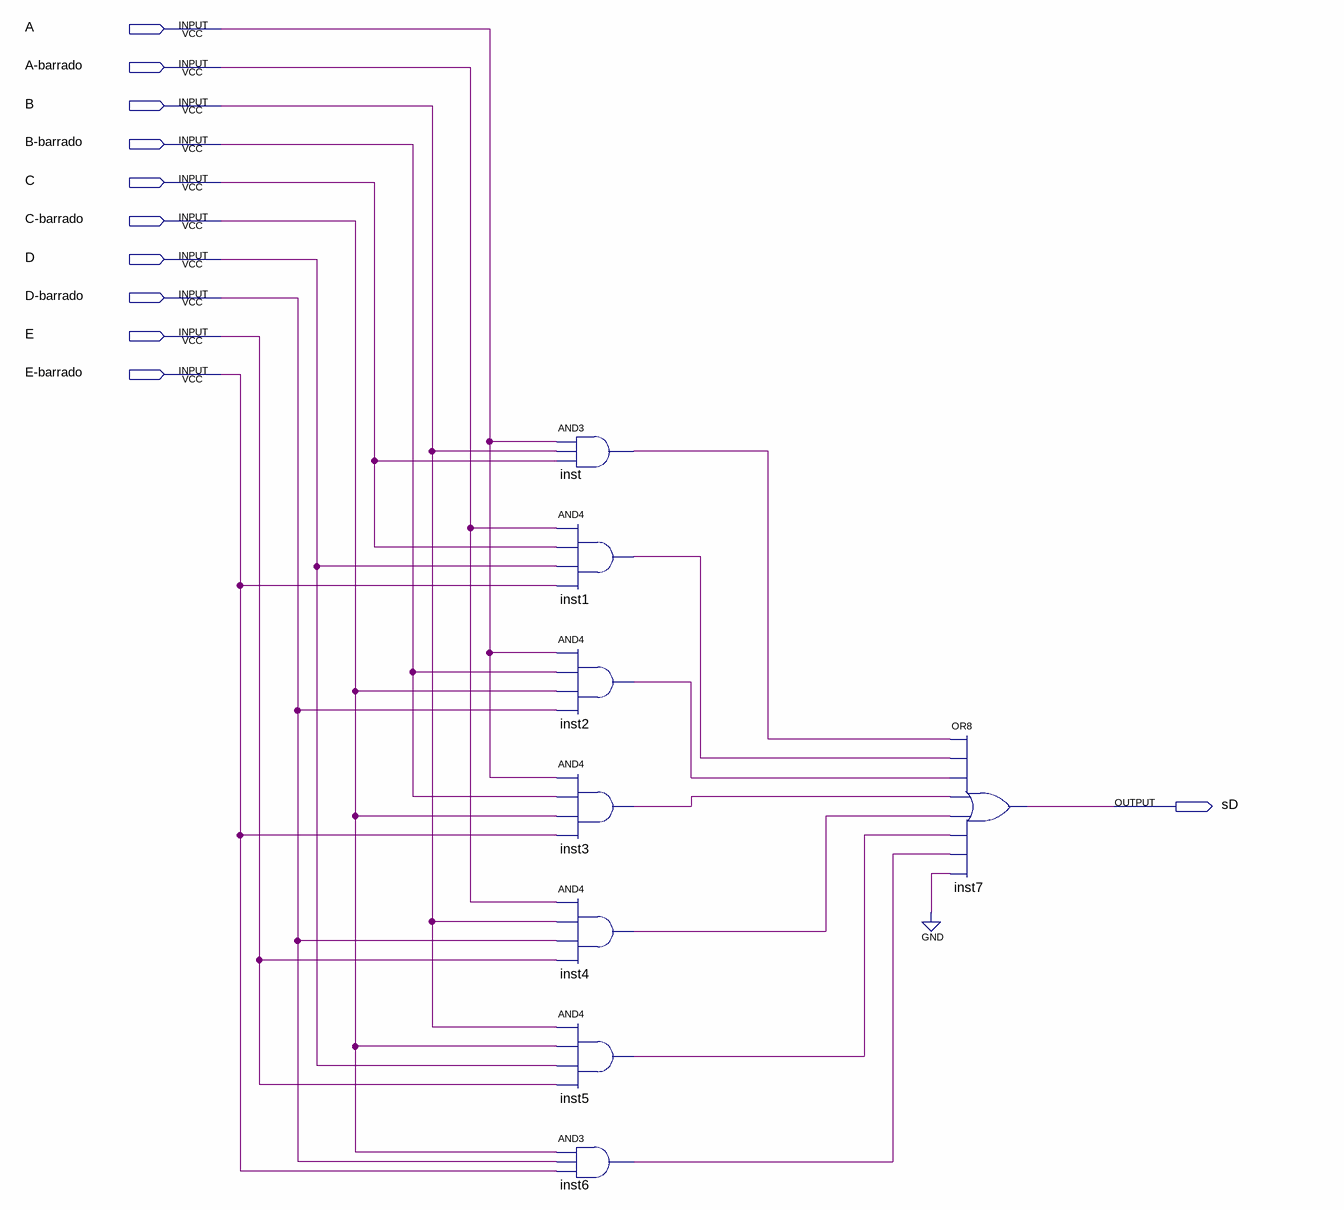
[diagram p0: schematic sheet]
// Quartus schematic saida_D.bdf as structural Verilog: 8 symbols, 11 pins
module saida_D (
  input  A,
  input  \A-barrado ,
  input  B,
  input  \B-barrado ,
  input  C,
  input  \C-barrado ,
  input  D,
  input  \D-barrado ,
  input  E,
  input  \E-barrado ,
  output sD
);

  wire inst1_out, inst2_out, inst3_out, inst4_out, inst5_out, inst6_out, inst_out;

  and inst (inst_out, A, B, C);
  and inst1 (inst1_out, \A-barrado , C, D, \E-barrado );
  and inst2 (inst2_out, A, \B-barrado , \C-barrado , \D-barrado );
  and inst3 (inst3_out, A, \B-barrado , \C-barrado , \E-barrado );
  and inst4 (inst4_out, \A-barrado , B, \D-barrado , E);
  and inst5 (inst5_out, B, \C-barrado , D, E);
  and inst6 (inst6_out, \C-barrado , \D-barrado , \E-barrado );
  or inst7 (sD, inst_out, inst1_out, inst2_out, inst3_out, inst4_out, inst5_out, inst6_out, 1'b0);
endmodule
